# Altium project Stepper Motor Driver With DRV8825.PrjPCB
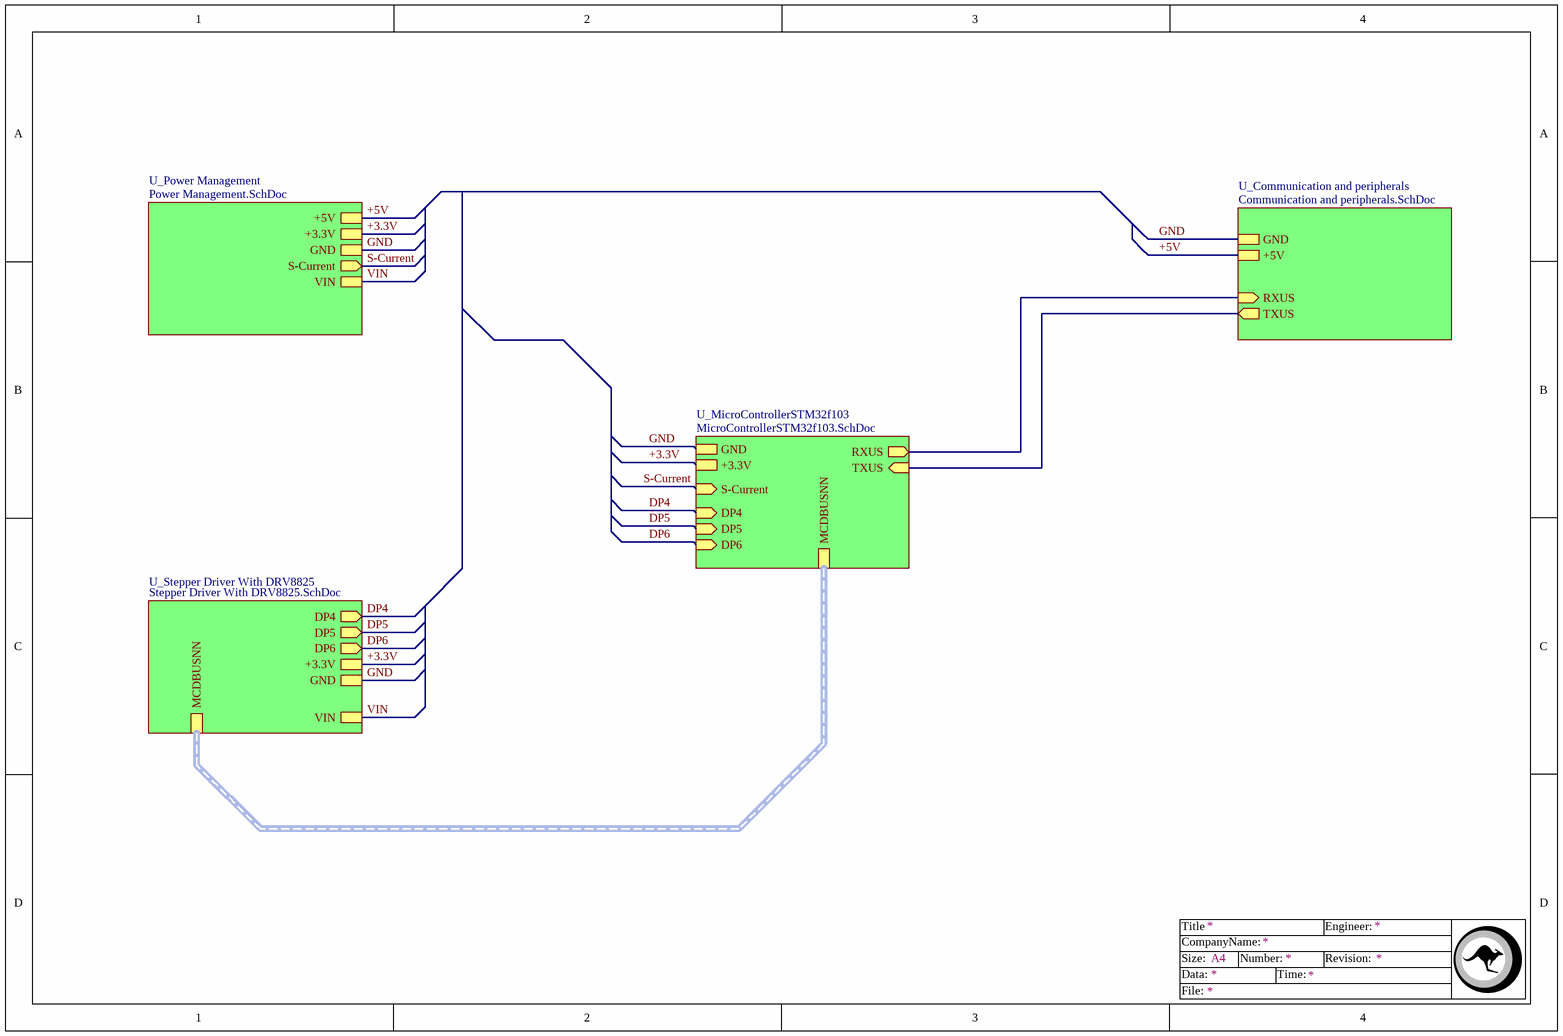
[diagram p0: A dashBoard of Stepper Motor Driver With DRV8825.SchDoc]
5 sheets, 91 parts. Net scope: hierarchical (ports join the sheet entries above them; power ports are global).
Board file: Stepper Motor Driver With DRV8825.PcbDoc
Sheets:
  A dashBoard of Stepper Motor Driver With DRV8825.SchDoc
    U_Communication and peripherals = Communication and peripherals.SchDoc
    U_Power Management = Power Management.SchDoc
    U_MicroControllerSTM32f103 = MicroControllerSTM32f103.SchDoc
    U_Stepper Driver With DRV8825 = Stepper Driver With DRV8825.SchDoc

## Sheet A dashBoard of Stepper Motor Driver With DRV8825.SchDoc
size A4

### Sub-sheets
U_Communication and peripherals = Communication and peripherals.SchDoc: TXUS (out), RXUS (in), GND, +5V
U_MicroControllerSTM32f103 = MicroControllerSTM32f103.SchDoc: GND, +3.3V, RXUS (out), TXUS (in), DP4 (in), DP5 (in), DP6 (in), MCDBUSNN (harness MCDBUSNN), S-Current (in)
U_Power Management = Power Management.SchDoc: +5V, +3.3V, GND, S-Current (out), VIN
U_Stepper Driver With DRV8825 = Stepper Driver With DRV8825.SchDoc: VIN, DP4 (out), DP5 (out), DP6 (out), GND, +3.3V, MCDBUSNN (harness MCDBUSNN)

### Nets
+3.3V: sheet U_Power Management/+3.3V, sheet U_MicroControllerSTM32f103/+3.3V, sheet U_Stepper Driver With DRV8825/+3.3V
+5V: sheet U_Communication and peripherals/+5V, sheet U_Power Management/+5V
GND: sheet U_Communication and peripherals/GND, sheet U_Power Management/GND, sheet U_MicroControllerSTM32f103/GND, sheet U_Stepper Driver With DRV8825/GND
VIN: sheet U_Power Management/VIN, sheet U_Stepper Driver With DRV8825/VIN
DP4: sheet U_MicroControllerSTM32f103/DP4, sheet U_Stepper Driver With DRV8825/DP4
DP5: sheet U_MicroControllerSTM32f103/DP5, sheet U_Stepper Driver With DRV8825/DP5
DP6: sheet U_MicroControllerSTM32f103/DP6, sheet U_Stepper Driver With DRV8825/DP6
RXUS: sheet U_Communication and peripherals/RXUS, sheet U_MicroControllerSTM32f103/RXUS
S-Current: sheet U_Power Management/S-Current, sheet U_MicroControllerSTM32f103/S-Current
TXUS: sheet U_Communication and peripherals/TXUS, sheet U_MicroControllerSTM32f103/TXUS

### Buses and harness runs
harness sheet U_MicroControllerSTM32f103/MCDBUSNN = sheet U_Stepper Driver With DRV8825/MCDBUSNN

### Notes on the sheet
- Title
- Size:
- Data:
- CompanyName:
- A4
- Number:
- Time:
- Revision:
- Engineer:
- File:

## Sheet Communication and peripherals.SchDoc
size A4
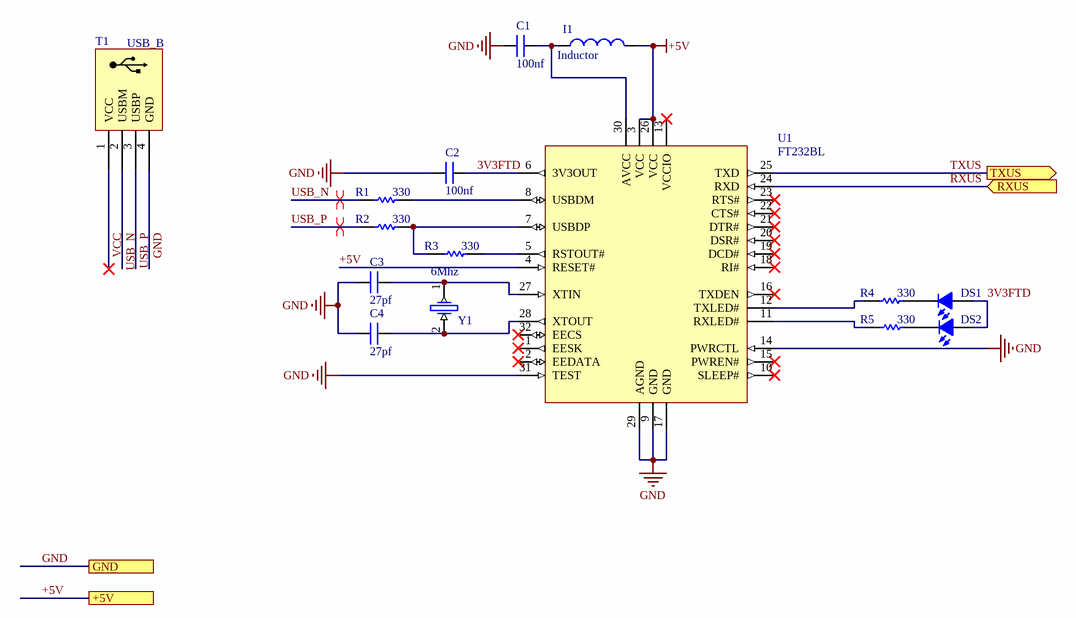
[diagram p1: Communication and peripherals.SchDoc]

### Parts
C1  100nf  [Cap0805]
C2  100nf  [Cap0805]
C3  27pf  [Cap0805]
C4  27pf  [Cap0805]
DS1  LED  [Led0805]  (value not drawn)
DS2  LED  [Led0805]  (value not drawn)
I1  Inductor  [1206]
R1  330  [R0805]
R2  330  [R0805]
R3  330  [R0805]
R4  330  [R0805]
R5  330  [R0805]
T1  USB_B  [USB_Dip_R]
U1  FT232BL  [LQFP-32_L]
Y1  6Mhz  [CrystallB]

### Ports
+5V, GND, RXUS (in), TXUS (out)

### Nets
+5V: I1.2 U1.3(VCC) U1.4(RESET#) U1.26(VCC) ; port +5V
GND: C1.2 C2.2 C3.1 C4.1 T1.4(GND) U1.9(GND) U1.14(PWRCTL) U1.17(GND) U1.29(AGND) U1.31(TEST) ; port GND
3V3FTD: C2.1 DS1.A DS2.A U1.6(3V3OUT)
RXUS: U1.24(RXD) ; port RXUS
TXUS: U1.25(TXD) ; port TXUS
USB_N: R1.1 T1.2(USBM)
USB_P: R2.1 T1.3(USBP)
VCC: T1.1(VCC)
NetC1_1: C1.1 I1.1 U1.30(AVCC)
NetC3_2: C3.2 U1.27(XTIN) Y1.1
NetC4_2: C4.2 U1.28(XTOUT) Y1.2
NetDS1_K: DS1.K R4.2
NetDS2_K: DS2.K R5.2
NetR1_2: R1.2 U1.8(USBDM)
NetR2_2: R2.2 R3.1 U1.7(USBDP)
NetR3_2: R3.2 U1.5(RSTOUT#)
NetR4_1: R4.1 U1.12(TXLED#)
NetR5_1: R5.1 U1.11(RXLED#)

Not connected (* = marked no-connect by the designer): U1 1(EESK)* 2(EEDATA)* 10(SLEEP#)* 13(VCCIO)* 15(PWREN#)* 16(TXDEN)* 18(RI#)* 19(DCD#)* 20(DSR#)* 21(DTR#)* 22(CTS#)* 23(RTS#)* 32(EECS)*

### Layout directives
differential pair: USB_N, USB_P

### Notes on the sheet
- Title
- Size:
- Data:
- CompanyName:
- A4
- Number:
- Time:
- Revision:
- Engineer:
- File:

### Library data of the parts
C1-C4 = Cap: Surface mount Capacitor
I1 = Inductor: Indicator
R1-R5 = Resistor
T1 = USB_B: USB B Connector
U1 = FT232BL: USB UART Asynchronous Serial Data Transfer Chip, LQFP-32, Pb-Free; DatasheetVersion: ver 2.2, Nov-2011; PackageVersion: 2010; PackageReference: LQFP-32; PackageDescription: 32-Pin Thin Quad Flat Pack 0.8 mm Pitch; ComponentLink1Description: Manufacturer URL; ComponentLink1URL: http://www.ftdichip.com/; ComponentLink2Description: Datasheet; ComponentLink2URL: http://www.ftdichip.com/Support/Documents/DataSheets/ICs/DS_FT232BL_BQ.pdf
Y1 = Crystal

## Sheet Power Management.SchDoc
size A4
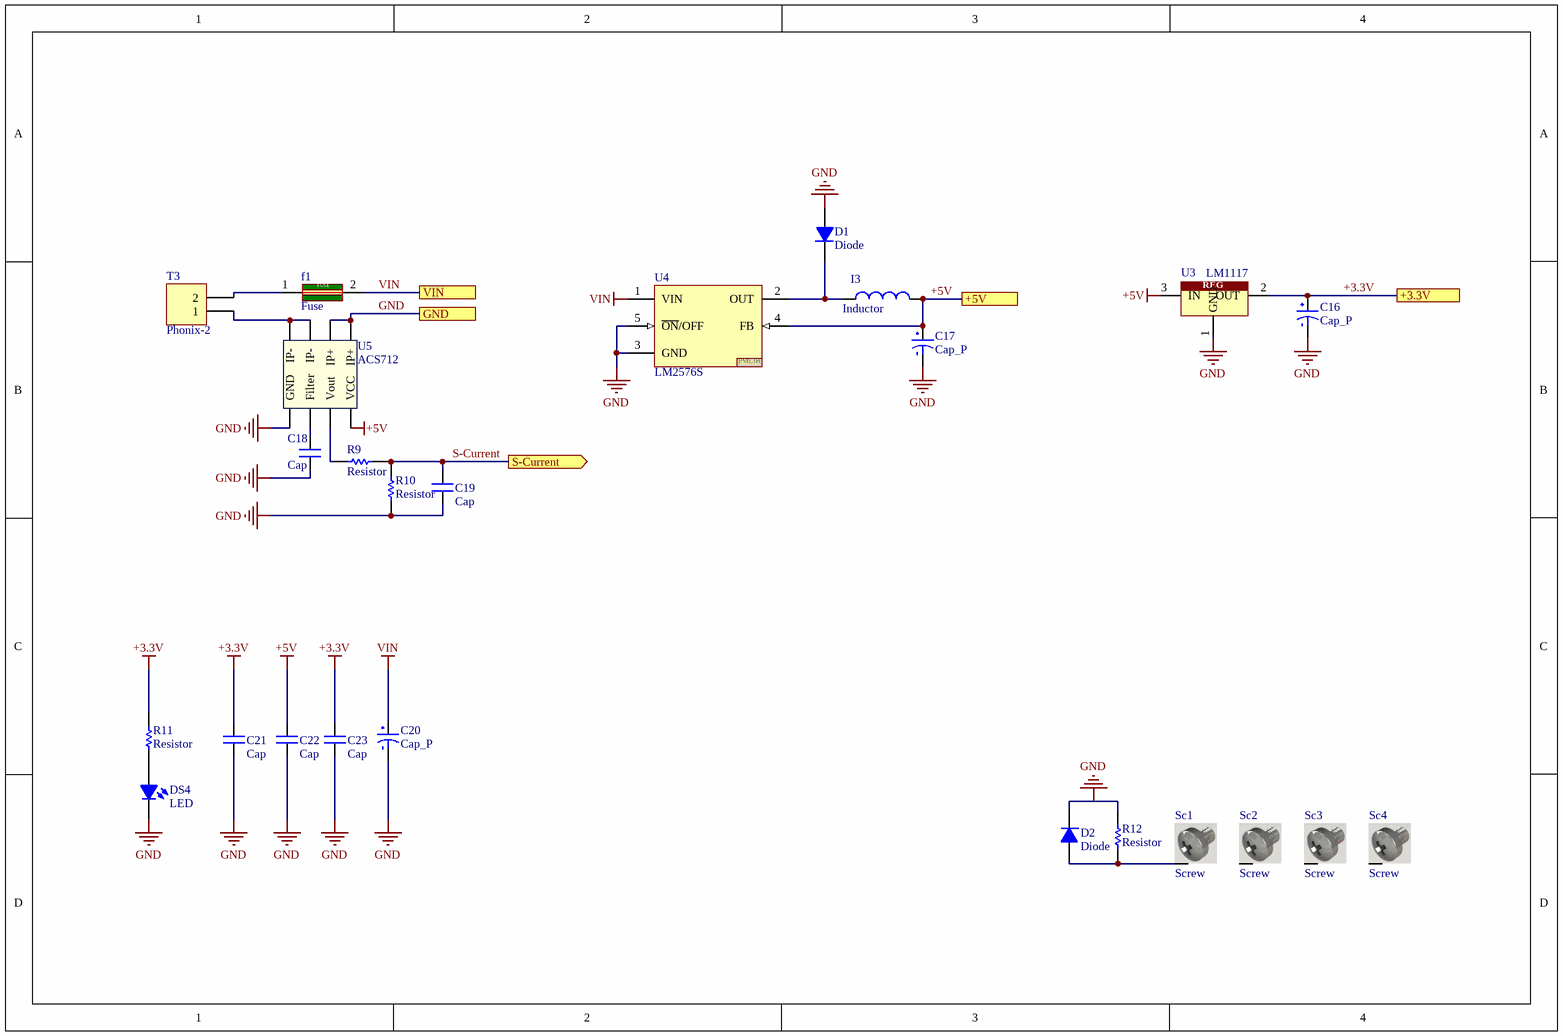
[diagram p2: Power Management.SchDoc]

### Parts
C16  Cap_P  [Cap_4mm]
C17  Cap_P  [Cap_4mm]
C18  Cap  [Cap0805]
C19  Cap  [Cap0805]
C20  Cap_P  [Cap_5mm]
C21  Cap  [Cap0805]
C22  Cap  [Cap0805]
C23  Cap  [Cap0805]
D1  Diode  [Diod-1A-SMD]
D2  Diode  [Diod-1A-SMD]
DS4  LED  [Led0805]
f1  Fuse  [1206]
I3  Inductor  [Indicator_SMD]
R9  Resistor  [R0805]
R10  Resistor  [R0805]
R11  Resistor  [R0805]
R12  Resistor  [0603]
Sc1  Screw  [Screw]
Sc2  Screw  [Screw]
Sc3  Screw  [Screw]
Sc4  Screw  [Screw]
T3  Phonix-2  [Phonix-2]
U3  LM1117  [DPACK]
U4  LM2576S  [LM2576S]
U5  ACS712  [SOP8]

### Ports
+3.3V, +5V, GND, S-Current (out), VIN

### Nets
+3.3V: C16.2 C21.2 C23.2 R11.1 U3.2(OUT) ; port +3.3V
+5V: C17.2 C22.2 I3.2 U3.3(IN) U4.4(FB) U5.8(VCC) ; port +5V
GND: C16.1 C17.1 C18.1 C19.1 C20.1 C21.1 C22.1 C23.1 D1.A D2.K DS4.K R10.2 R12.1 U3.1(GND) U4.3(GND) U4.5(~{ON}/OFF) U5.1(IP+) U5.2(IP+) U5.5(GND) ; port GND
VIN: C20.2 f1.2(OUT) U4.1(VIN) ; port VIN
S-Current: C19.2 R9.1 R10.1 ; port S-Current
NetC18_2: C18.2 U5.6(Filter)
NetD1_K: D1.K I3.1 U4.2(OUT)
NetD2_A: D2.A R12.2 Sc1.S
NetDS4_A: DS4.A R11.2
Netf1_1: f1.1(IN) T3.2
NetR9_2: R9.2 U5.7(Vout)
NetT3_1: T3.1 U5.3(IP-) U5.4(IP-)

Not connected (* = marked no-connect by the designer): Sc2 S; Sc3 S; Sc4 S

### Notes on the sheet
- Title
- Size:
- Data:
- CompanyName:
- A4
- Number:
- Time:
- Revision:
- Engineer:
- File:
- (in symbol Fuse) FUSE
- (in symbol LM1117) REG
- (in symbol LM2576S) PMLIB

### Library data of the parts
C16 C17 C20 = Cap_P: Polarity
C18 C19 C21-C23 = Cap: Surface mount Capacitor
I3 = Inductor: Indicator
Sc1-Sc4 = Screw: Screw 3mm
T3 = Phonix-2: Connector
U3 = LM1117: Regulator
U4 = LM2576S: Regulator
U5 = ACS712: Hall effect Current Sensor

## Sheet MicroControllerSTM32f103.SchDoc
size A4
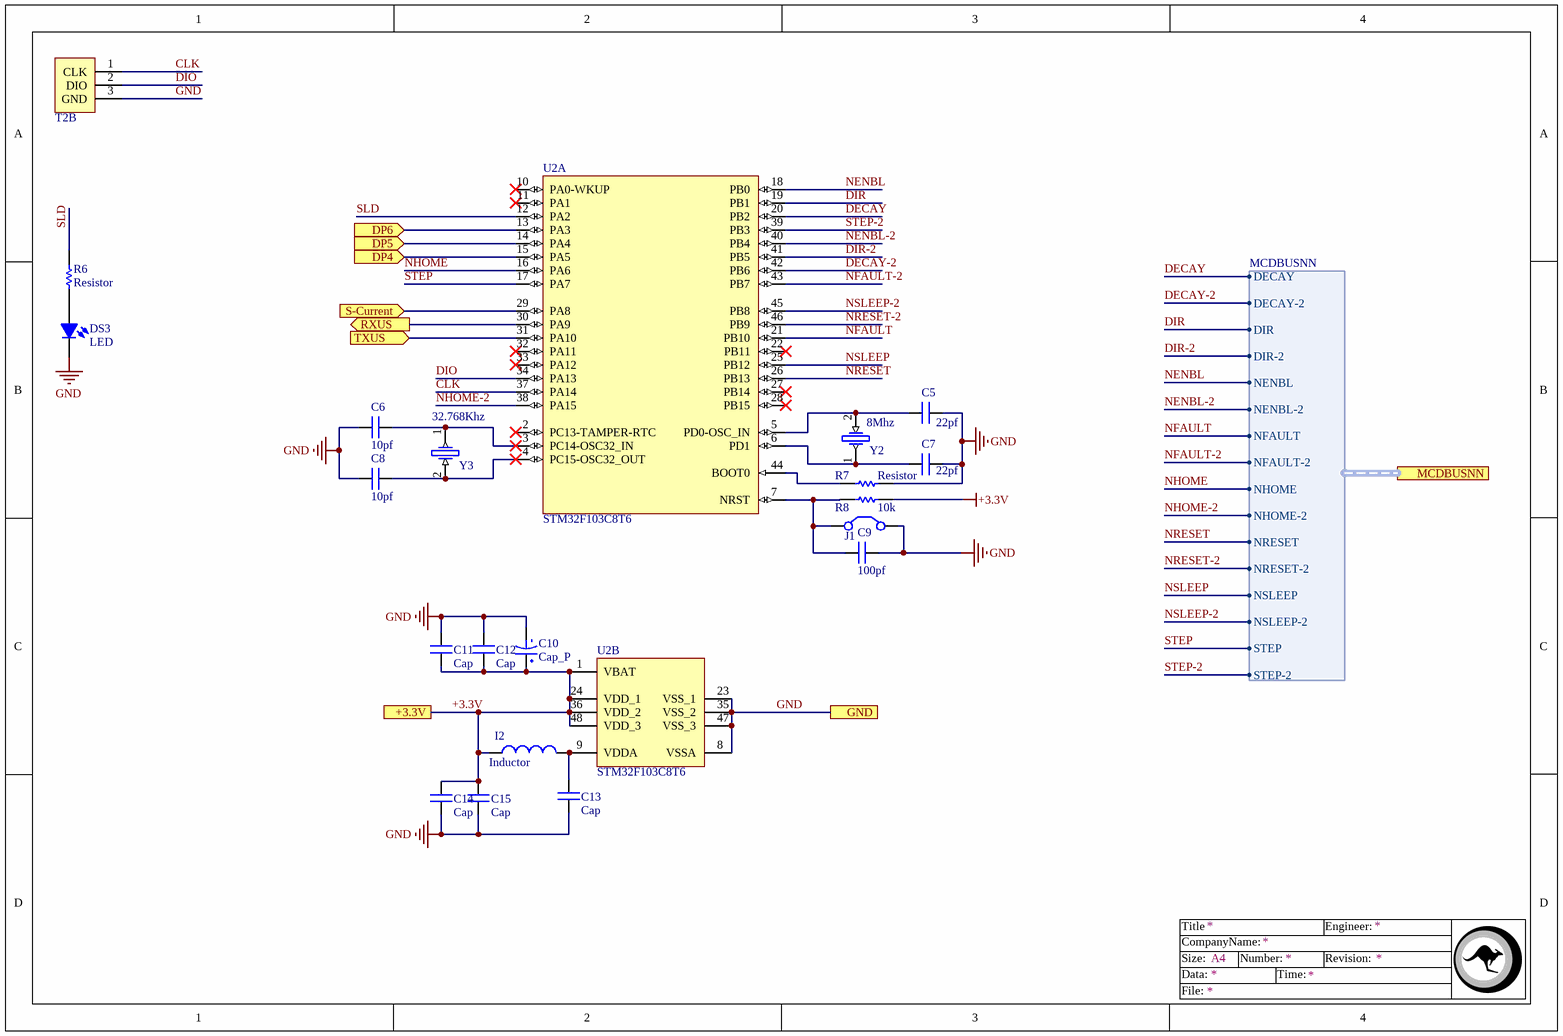
[diagram p3: MicroControllerSTM32f103.SchDoc]

### Parts
C5  22pf  [Cap0805]
C6  10pf  [Cap0805]
C7  22pf  [Cap0805]
C8  10pf  [Cap0805]
C9  100pf  [Cap0805]
C10  Cap_P  [CAPMOL_C]
C11  Cap  [Cap0805]
C12  Cap  [Cap0805]
C13  Cap  [Cap0805]
C14  Cap  [Cap0805]
C15  Cap  [Cap0805]
DS3  LED  [Led0805]
I2  Inductor  [1206]
J1  Jumper  [Jumper SMD - Small]  (value not drawn)
R6  Resistor  [R0805]
R7  Resistor  [R0805]
R8  10k  [R0805]
T2  Serial Program  [MHDR1X03-254P - E]  (value not drawn)  (part B of 2)
U2  STM32F103C8T6  [LQFP48_L]  (parts A,B of 2)
Y2  8Mhz  [CrystallB]
Y3  32.768Khz  [CrystallB]

### Ports
+3.3V, DP4 (in), DP5 (in), DP6 (in), GND, MCDBUSNN (harness MCDBUSNN), RXUS (out), S-Current (in), TXUS (in)

### Harnesses
MCDBUSNN: DECAY, DECAY-2, DIR, DIR-2, NENBL, NENBL-2, NFAULT, NFAULT-2, NHOME, NHOME-2, NRESET, NRESET-2, NSLEEP, NSLEEP-2, STEP, STEP-2

### Nets
+3.3V: C10.2 C11.1 C12.1 C14.2 C15.2 I2.1 R8.1 U2.1(VBAT) U2.24(VDD_1) U2.36(VDD_2) U2.48(VDD_3) ; port +3.3V
GND: C5.1 C6.1 C7.1 C8.1 C9.2 C10.1 C11.2 C12.2 C13.1 C14.1 C15.1 DS3.K J1.2(C2) R7.2 T2.3(GND) U2.8(VSSA) U2.23(VSS_1) U2.35(VSS_2) U2.47(VSS_3) ; port GND
CLK: T2.1(CLK) U2.37(PA14)
DECAY: U2.20(PB2) ; port MCDBUSNN.DECAY
DECAY-2: U2.42(PB6) ; port MCDBUSNN.DECAY-2
DIO: T2.2(DIO) U2.34(PA13)
DIR: U2.19(PB1) ; port MCDBUSNN.DIR
DIR-2: U2.41(PB5) ; port MCDBUSNN.DIR-2
DP4: U2.15(PA5) ; port DP4
DP5: U2.14(PA4) ; port DP5
DP6: U2.13(PA3) ; port DP6
NENBL: U2.18(PB0) ; port MCDBUSNN.NENBL
NENBL-2: U2.40(PB4) ; port MCDBUSNN.NENBL-2
NFAULT: U2.21(PB10) ; port MCDBUSNN.NFAULT
NFAULT-2: U2.43(PB7) ; port MCDBUSNN.NFAULT-2
NHOME: U2.16(PA6) ; port MCDBUSNN.NHOME
NHOME-2: U2.38(PA15) ; port MCDBUSNN.NHOME-2
NRESET: U2.26(PB13) ; port MCDBUSNN.NRESET
NRESET-2: U2.46(PB9) ; port MCDBUSNN.NRESET-2
NSLEEP: U2.25(PB12) ; port MCDBUSNN.NSLEEP
NSLEEP-2: U2.45(PB8) ; port MCDBUSNN.NSLEEP-2
RXUS: U2.30(PA9) ; port RXUS
S-Current: U2.29(PA8) ; port S-Current
SLD: R6.1 U2.12(PA2)
STEP: U2.17(PA7) ; port MCDBUSNN.STEP
STEP-2: U2.39(PB3) ; port MCDBUSNN.STEP-2
TXUS: U2.31(PA10) ; port TXUS
NetC5_2: C5.2 U2.5(PD0-OSC_IN) Y2.2
NetC6_2: C6.2 U2.3(PC14-OSC32_IN) Y3.1
NetC7_2: C7.2 U2.6(PD1) Y2.1
NetC8_2: C8.2 U2.4(PC15-OSC32_OUT) Y3.2
NetC9_1: C9.1 J1.1(C1) R8.2 U2.7(NRST)
NetC13_2: C13.2 I2.2 U2.9(VDDA)
NetDS3_A: DS3.A R6.2
NetR7_1: R7.1 U2.44(BOOT0)

Not connected (* = marked no-connect by the designer): U2 2(PC13-TAMPER-RTC)* 10(PA0-WKUP)* 11(PA1)* 22(PB11)* 27(PB14)* 28(PB15)* 32(PA11)* 33(PA12)*

### Notes on the sheet
- Title
- Size:
- Data:
- CompanyName:
- A4
- Number:
- Time:
- Revision:
- Engineer:
- File:

### Library data of the parts
C5-C9 C11-C15 = Cap: Surface mount Capacitor
C10 = Cap_P: Polarity
I2 = Inductor: Indicator
R8 = Resistor
T2 = Serial Program: STM Serial Program pin
U2 = STM32F103C8T6: STM32 ARM-based 32-bit MCU Performance Line with 64 kB Flash, 20 kB Internal RAM, -40 to +85°C Temperature, 48-Pin LQFP, Tray; DatasheetVersion: rev13.0, Apr-2011; PackageVersion: rev13, Apr-2011; PackageReference: LQFP48; PackageDescription: 48-Pin Low-Profile Quad Flat Pack, 7 x 7 mm Body, 0.5 mm Pitch (LQFP48); ComponentLink1Description: Manufacturer URL; ComponentLink1URL: http://www.st.com/; ComponentLink2Description: STM32F103 Datasheet; ComponentLink2URL: http://www.st.com/internet/com/TECHNICAL_RESOURCES/TECHNICAL_LITERATURE/DATASHEET/CD00161566.pdf; ComponentLink3Description: STM32 Family Web Page; ComponentLink3URL: www.st.com/stm32
Y2 Y3 = Crystal

## Sheet Stepper Driver With DRV8825.SchDoc
size A4
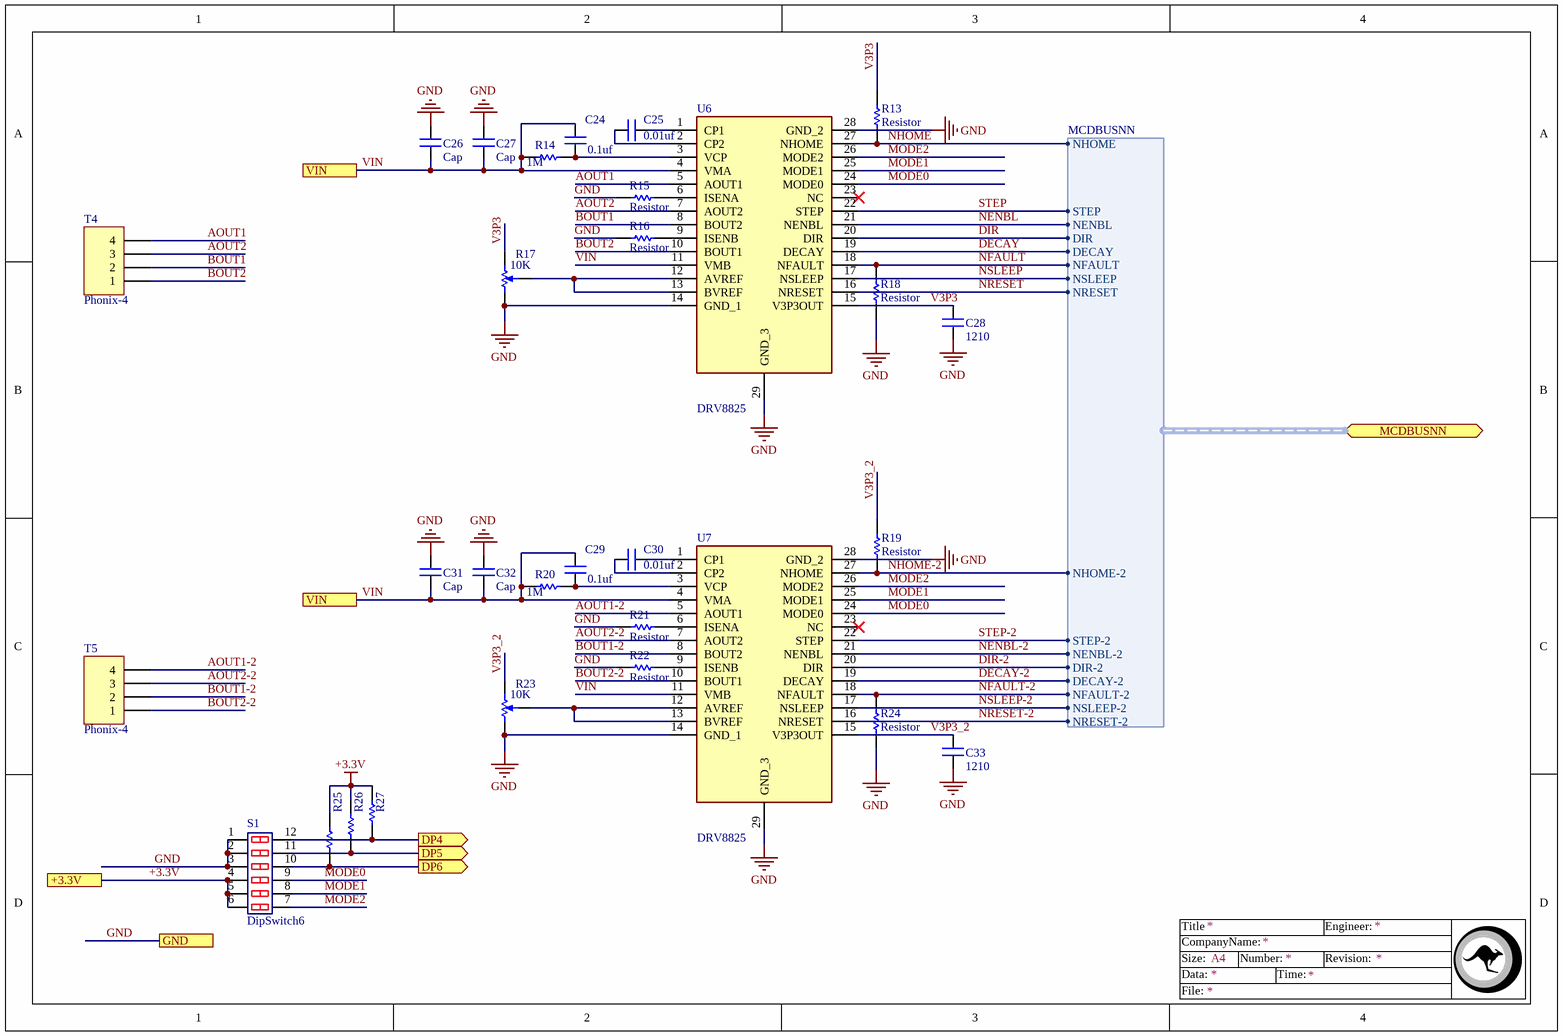
[diagram p4: Stepper Driver With DRV8825.SchDoc]

### Parts
C24  0.1uf  [Cap0805]
C25  0.01uf  [Cap0805]
C26  Cap  [Cap0805]
C27  Cap  [Cap0805]
C28  1210  [CAP1206]
C29  0.1uf  [Cap0805]
C30  0.01uf  [Cap0805]
C31  Cap  [Cap0805]
C32  Cap  [Cap0805]
C33  1210  [CAP1206]
R13  Resistor  [R0805]
R14  1M  [R0805]
R15  Resistor  [R0805]
R16  Resistor  [R0805]
R17  value 10K  [POT4MM-Small Pot]  (hidden comment: RPot SM)
R18  Resistor  [R0805]
R19  Resistor  [R0805]
R20  1M  [R0805]
R21  Resistor  [R0805]
R22  Resistor  [R0805]
R23  value 10K  [POT4MM-Small Pot]  (hidden comment: RPot SM)
R24  Resistor  [R0805]
R25  Resistor  [R0805]  (value not drawn)
R26  Resistor  [R0805]  (value not drawn)
R27  Resistor  [R0805]  (value not drawn)
S1  DipSwitch6  [DIPSW6]
T4  Phonix-4  [Phonix-4]
T5  Phonix-4  [Phonix-4]
U6  DRV8825  [SOP65P640X120-29N]
U7  DRV8825  [SOP65P640X120-29N]

### Ports
+3.3V, DP4 (out), DP5 (out), DP6 (out), GND, MCDBUSNN (bidir, harness MCDBUSNN), VIN

### Harnesses
MCDBUSNN: NHOME, STEP, NENBL, DIR, DECAY, NFAULT, NSLEEP, NRESET, NHOME-2, STEP-2, NENBL-2, DIR-2, DECAY-2, NFAULT-2, NSLEEP-2, NRESET-2

### Nets
+3.3V: R25.1 R26.1 R27.1 S1.4 S1.5 S1.6 ; port +3.3V
GND: C26.2 C27.2 C28.1 C31.2 C32.2 C33.1 R15.2 R16.2 R17.CCW(-) R18.2 R21.2 R22.2 R23.CCW(-) R24.2 S1.1 S1.2 S1.3 U6.14(GND_1) U6.28(GND_2) U6.29(GND_3) U7.14(GND_1) U7.28(GND_2) U7.29(GND_3) ; port GND
VIN: C24.2 C26.1 C27.1 C29.2 C31.1 C32.1 R14.2 R20.2 U6.4(VMA) U6.11(VMB) U7.4(VMA) U7.11(VMB) ; port VIN
AOUT1: T4.4 U6.5(AOUT1)
AOUT1-2: T5.4 U7.5(AOUT1)
AOUT2: T4.3 U6.7(AOUT2)
AOUT2-2: T5.3 U7.7(AOUT2)
BOUT1: T4.2 U6.8(BOUT2)
BOUT1-2: T5.2 U7.8(BOUT2)
BOUT2: T4.1 U6.10(BOUT1)
BOUT2-2: T5.1 U7.10(BOUT1)
DECAY: U6.19(DECAY) ; port MCDBUSNN.DECAY
DECAY-2: U7.19(DECAY) ; port MCDBUSNN.DECAY-2
DIR: U6.20(DIR) ; port MCDBUSNN.DIR
DIR-2: U7.20(DIR) ; port MCDBUSNN.DIR-2
DP4: R27.2 S1.12 ; port DP4
DP5: R26.2 S1.11 ; port DP5
DP6: R25.2 S1.10 ; port DP6
MODE0: S1.9 U6.24(MODE0) U7.24(MODE0)
MODE1: S1.8 U6.25(MODE1) U7.25(MODE1)
MODE2: S1.7 U6.26(MODE2) U7.26(MODE2)
NENBL: U6.21(NENBL) ; port MCDBUSNN.NENBL
NENBL-2: U7.21(NENBL) ; port MCDBUSNN.NENBL-2
NFAULT: R18.1 U6.18(NFAULT) ; port MCDBUSNN.NFAULT
NFAULT-2: R24.1 U7.18(NFAULT) ; port MCDBUSNN.NFAULT-2
NHOME: R13.2 U6.27(NHOME) ; port MCDBUSNN.NHOME
NHOME-2: R19.2 U7.27(NHOME) ; port MCDBUSNN.NHOME-2
NRESET: U6.16(NRESET) ; port MCDBUSNN.NRESET
NRESET-2: U7.16(NRESET) ; port MCDBUSNN.NRESET-2
NSLEEP: U6.17(NSLEEP) ; port MCDBUSNN.NSLEEP
NSLEEP-2: U7.17(NSLEEP) ; port MCDBUSNN.NSLEEP-2
STEP: U6.22(STEP) ; port MCDBUSNN.STEP
STEP-2: U7.22(STEP) ; port MCDBUSNN.STEP-2
V3P3: C28.2 R13.1 R17.CW(+) U6.15(V3P3OUT)
V3P3_2: C33.2 R19.1 R23.CW(+) U7.15(V3P3OUT)
NetC24_1: C24.1 R14.1 U6.3(VCP)
NetC25_1: C25.1 U6.2(CP2)
NetC25_2: C25.2 U6.1(CP1)
NetC29_1: C29.1 R20.1 U7.3(VCP)
NetC30_1: C30.1 U7.2(CP2)
NetC30_2: C30.2 U7.1(CP1)
NetR15_1: R15.1 U6.6(ISENA)
NetR16_1: R16.1 U6.9(ISENB)
NetR17_W: R17.W U6.12(AVREF) U6.13(BVREF)
NetR21_1: R21.1 U7.6(ISENA)
NetR22_1: R22.1 U7.9(ISENB)
NetR23_W: R23.W U7.12(AVREF) U7.13(BVREF)

Not connected (* = marked no-connect by the designer): U6 23(NC)*; U7 23(NC)*

### Notes on the sheet
- Title
- Size:
- Data:
- CompanyName:
- A4
- Number:
- Time:
- Revision:
- Engineer:
- File:

### Library data of the parts
C24-C33 = Cap: Surface mount Capacitor
R14 R20 = Resistor
R15 R16 = Resistor: 200 m
R17 R23 = RPot SM: Square Trimming Potentiometer; Published: 17-Dec-2003; DatasheetVersion: Oct-2003; PackageReference: POT4MM-2; Publisher: Altium Limited; PackageDescription: Square Trimming Potentiometer; ComponentLink1Description: Manufacturer Link; ComponentLink1URL: http://bourns.com/2/search.html
S1 = DipSwitch6: DipSwitch6pin
T4 T5 = Phonix-4: Connector
U6 U7 = DRV8825: Stepper Motor Driver

## Nets that join several sheets
+3.3V: Power Management (5 pins), MicroControllerSTM32f103 (11 pins), Stepper Driver With DRV8825 (6 pins)
+5V: Communication and peripherals (I1.2 U1.3 U1.4 U1.26), Power Management (6 pins)
GND: Communication and peripherals (10 pins), Power Management (19 pins), MicroControllerSTM32f103 (19 pins), Stepper Driver With DRV8825 (23 pins)
VIN: Power Management (C20.2 f1.2 U4.1), Stepper Driver With DRV8825 (12 pins)
DECAY: MicroControllerSTM32f103 (U2.20), Stepper Driver With DRV8825 (U6.19)
DECAY-2: MicroControllerSTM32f103 (U2.42), Stepper Driver With DRV8825 (U7.19)
DIR: MicroControllerSTM32f103 (U2.19), Stepper Driver With DRV8825 (U6.20)
DIR-2: MicroControllerSTM32f103 (U2.41), Stepper Driver With DRV8825 (U7.20)
DP4: MicroControllerSTM32f103 (U2.15), Stepper Driver With DRV8825 (R27.2 S1.12)
DP5: MicroControllerSTM32f103 (U2.14), Stepper Driver With DRV8825 (R26.2 S1.11)
DP6: MicroControllerSTM32f103 (U2.13), Stepper Driver With DRV8825 (R25.2 S1.10)
NENBL: MicroControllerSTM32f103 (U2.18), Stepper Driver With DRV8825 (U6.21)
NENBL-2: MicroControllerSTM32f103 (U2.40), Stepper Driver With DRV8825 (U7.21)
NFAULT: MicroControllerSTM32f103 (U2.21), Stepper Driver With DRV8825 (R18.1 U6.18)
NFAULT-2: MicroControllerSTM32f103 (U2.43), Stepper Driver With DRV8825 (R24.1 U7.18)
NHOME: MicroControllerSTM32f103 (U2.16), Stepper Driver With DRV8825 (R13.2 U6.27)
NHOME-2: MicroControllerSTM32f103 (U2.38), Stepper Driver With DRV8825 (R19.2 U7.27)
NRESET: MicroControllerSTM32f103 (U2.26), Stepper Driver With DRV8825 (U6.16)
NRESET-2: MicroControllerSTM32f103 (U2.46), Stepper Driver With DRV8825 (U7.16)
NSLEEP: MicroControllerSTM32f103 (U2.25), Stepper Driver With DRV8825 (U6.17)
NSLEEP-2: MicroControllerSTM32f103 (U2.45), Stepper Driver With DRV8825 (U7.17)
RXUS: Communication and peripherals (U1.24), MicroControllerSTM32f103 (U2.30)
S-Current: Power Management (C19.2 R9.1 R10.1), MicroControllerSTM32f103 (U2.29)
STEP: MicroControllerSTM32f103 (U2.17), Stepper Driver With DRV8825 (U6.22)
STEP-2: MicroControllerSTM32f103 (U2.39), Stepper Driver With DRV8825 (U7.22)
TXUS: Communication and peripherals (U1.25), MicroControllerSTM32f103 (U2.31)